# Altium project Projeto_DAC_Raspberry.PrjPcb
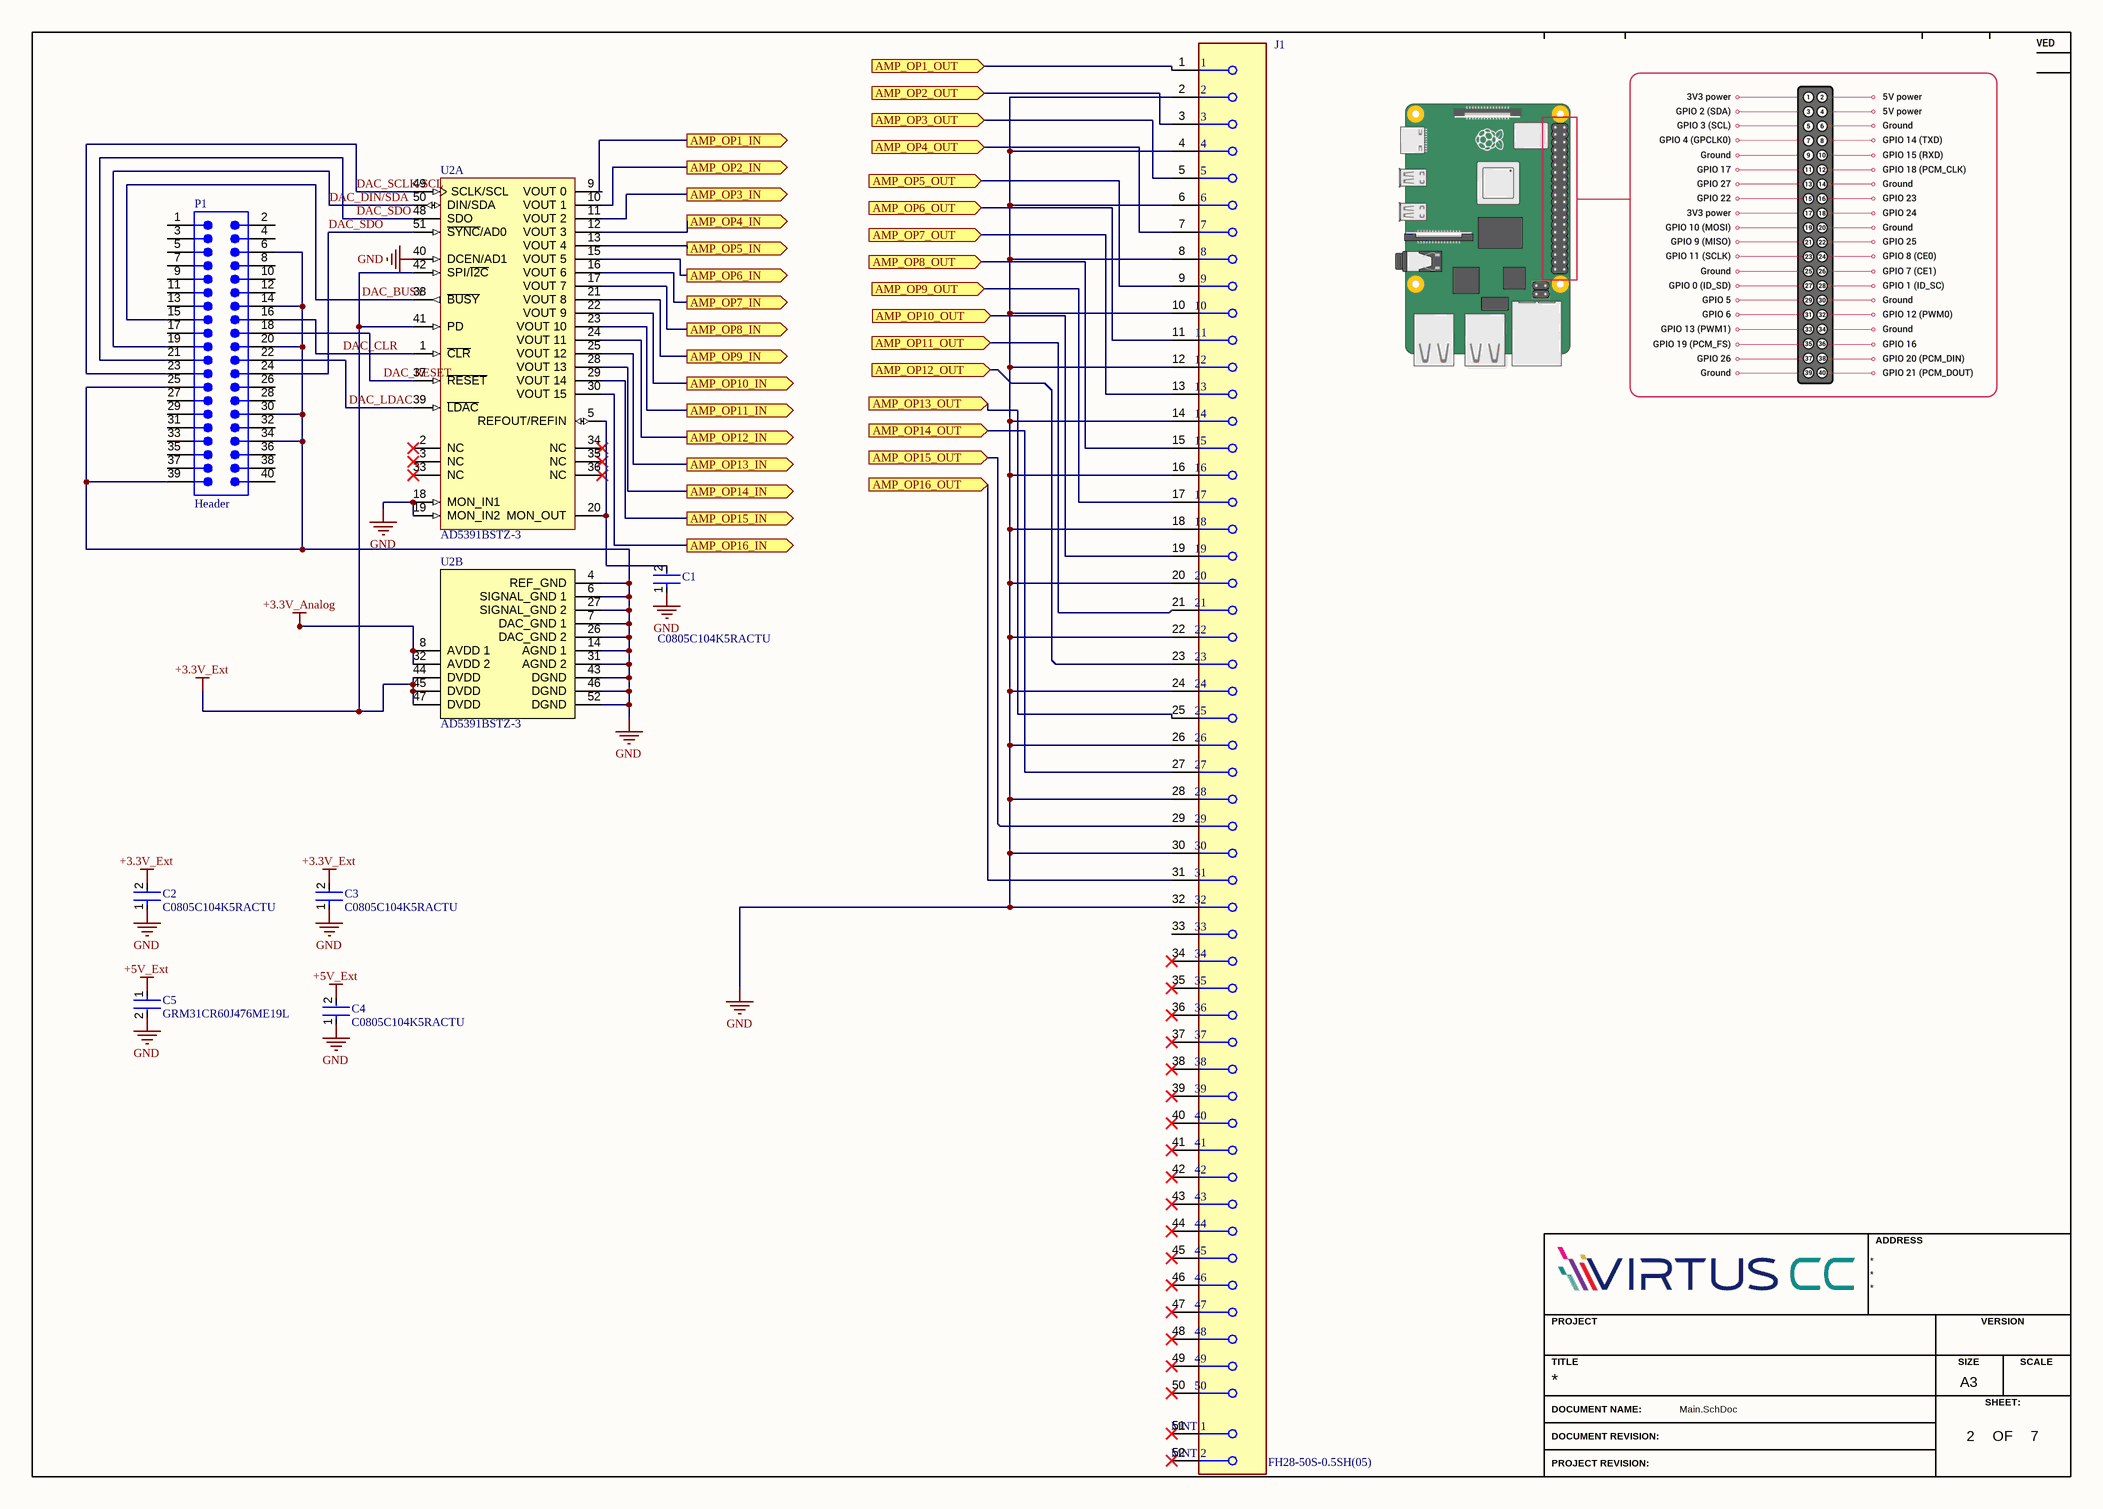
[diagram p0: Main.SchDoc]
1 sheet, 8 parts. Net scope: global (net labels, ports and power ports of the same name join across sheets).
Board file: RaspberryHatBoard1.PcbDoc

## Sheet Main.SchDoc
size A3; SheetNumber: 2; SheetTotal: 7

### Parts
C1  C0805C104K5RACTU  [FP-C0805C-DN-MFG]
C2  C0805C104K5RACTU  [FP-C0805C-DN-MFG]
C3  C0805C104K5RACTU  [FP-C0805C-DN-MFG]
C4  C0805C104K5RACTU  [FP-C0805C-DN-MFG]
C5  GRM31CR60J476ME19L  [FP-GRM31C-0_2-e0_3_0_8-IPC_C]
J1  FH28-50S-0.5SH(05)  [FP-FH28-50S-0_5SH_05-MFG]
P1  Header  [61204021621]
U2  AD5391BSTZ-3  [ST-52_L]  (parts A,B of 2)

### Ports
AMP_OP1_IN (out, see Amp_op1[2B]), AMP_OP1_OUT (in, see Amp_op1[6A]), AMP_OP2_IN (out, see Amp_op1[2B]), AMP_OP2_OUT (in, see Amp_op1[6B]), AMP_OP3_IN (out, see Amp_op1[2B]), AMP_OP3_OUT (in, see Amp_op1[6B]), AMP_OP4_IN (out, see Amp_op1[2B]), AMP_OP4_OUT (in, see Amp_op1[6C]), AMP_OP5_IN (out, see Amp_op2[1B]), AMP_OP5_OUT (in, see Amp_op2[6A]), AMP_OP6_IN (out, see Amp_op2[1B]), AMP_OP6_OUT (in, see Amp_op2[6B]), AMP_OP7_IN (out, see Amp_op2[1B]), AMP_OP7_OUT (in, see Amp_op2[6C]), AMP_OP8_IN (out, see Amp_op2[1B]), AMP_OP8_OUT (in, see Amp_op2[6C]), AMP_OP9_IN (out, see Amp_op3[2B]), AMP_OP9_OUT (in, see Amp_op3[6A]), AMP_OP10_IN (out, see Amp_op3[2B]), AMP_OP10_OUT (in, see Amp_op3[6B]), AMP_OP11_IN (out, see Amp_op3[2B]), AMP_OP11_OUT (in, see Amp_op3[6B]), AMP_OP12_IN (out, see Amp_op3[2B]), AMP_OP12_OUT (in, see Amp_op3[6C]), AMP_OP13_IN (out, see Amp_op4[2B]), AMP_OP13_OUT (in, see Amp_op4[6A]), AMP_OP14_IN (out, see Amp_op4[2B]), AMP_OP14_OUT (in, see Amp_op4[6B]), AMP_OP15_IN (out, see Amp_op4[2B]), AMP_OP15_OUT (in, see Amp_op4[6B]), AMP_OP16_IN (out, see Amp_op4[2B]), AMP_OP16_OUT (in, see Amp_op4[6C])

### Nets
+3.3V_Analog: U2.8(AVDD_1) U2.32(AVDD_2)
+3.3V_Ext: C2.2 C3.2 U2.41(PD) U2.42(SPI/~{I2C}) U2.44(DVDD) U2.45(DVDD) U2.47(DVDD)
+5V_Ext: C4.2 C5.1
GND: C1.1 C2.1 C3.1 C4.1 C5.2 J1.2 J1.4 J1.6 J1.8 J1.10 J1.12 J1.14 J1.16 J1.18 J1.20 J1.22 J1.24 J1.26 J1.28 J1.30 J1.32 P1.6 P1.14 P1.20 P1.25 P1.30 P1.34 P1.39 U2.4(REF_GND) U2.6(SIGNAL_GND_1) U2.7(DAC_GND_1) U2.14(AGND_1) U2.18(MON_IN1) U2.19(MON_IN2) U2.26(DAC_GND_2) U2.27(SIGNAL_GND_2) U2.31(AGND_2) U2.40(DCEN/AD1) U2.43(DGND) U2.46(DGND) U2.52(DGND)
DAC_BUSY: P1.15 U2.38(~{BUSY})
DAC_CLR: P1.16 U2.1(~{CLR})
DAC_DIN/SDA: P1.19 U2.50(DIN/SDA)
DAC_LDAC: P1.22 U2.39(~{LDAC})
DAC_RESET: P1.18 U2.37(~{RESET})
DAC_SCLK/SCL: P1.23 U2.49(SCLK/SCL)
DAC_SDO: P1.21 P1.24 U2.48(SDO) U2.51(~{SYNC}/AD0)
NetC1_2: C1.2 U2.5(REFOUT/REFIN) U2.20(MON_OUT)
NetJ1_1: J1.1 ; port AMP_OP1_OUT
NetJ1_3: J1.3 ; port AMP_OP2_OUT
NetJ1_5: J1.5 ; port AMP_OP3_OUT
NetJ1_7: J1.7 ; port AMP_OP4_OUT
NetJ1_9: J1.9 ; port AMP_OP5_OUT
NetJ1_11: J1.11 ; port AMP_OP6_OUT
NetJ1_13: J1.13 ; port AMP_OP7_OUT
NetJ1_15: J1.15 ; port AMP_OP8_OUT
NetJ1_17: J1.17 ; port AMP_OP9_OUT
NetJ1_19: J1.19 ; port AMP_OP10_OUT
NetJ1_21: J1.21 ; port AMP_OP11_OUT
NetJ1_23: J1.23 ; port AMP_OP12_OUT
NetJ1_25: J1.25 ; port AMP_OP13_OUT
NetJ1_27: J1.27 ; port AMP_OP14_OUT
NetJ1_29: J1.29 ; port AMP_OP15_OUT
NetJ1_31: J1.31 ; port AMP_OP16_OUT
NetU2_9: U2.9(VOUT_0) ; port AMP_OP1_IN
NetU2_10: U2.10(VOUT_1) ; port AMP_OP2_IN
NetU2_11: U2.11(VOUT_2) ; port AMP_OP3_IN
NetU2_12: U2.12(VOUT_3) ; port AMP_OP4_IN
NetU2_13: U2.13(VOUT_4) ; port AMP_OP5_IN
NetU2_15: U2.15(VOUT_5) ; port AMP_OP6_IN
NetU2_16: U2.16(VOUT_6) ; port AMP_OP7_IN
NetU2_17: U2.17(VOUT_7) ; port AMP_OP8_IN
NetU2_21: U2.21(VOUT_8) ; port AMP_OP9_IN
NetU2_22: U2.22(VOUT_9) ; port AMP_OP10_IN
NetU2_23: U2.23(VOUT_10) ; port AMP_OP11_IN
NetU2_24: U2.24(VOUT_11) ; port AMP_OP12_IN
NetU2_25: U2.25(VOUT_12) ; port AMP_OP13_IN
NetU2_28: U2.28(VOUT_13) ; port AMP_OP14_IN
NetU2_29: U2.29(VOUT_14) ; port AMP_OP15_IN
NetU2_30: U2.30(VOUT_15) ; port AMP_OP16_IN

Not connected (* = marked no-connect by the designer): J1 33 34* 35* 36* 37* 38* 39* 40* 41* 42* 43* 44* 45* 46* 47* 48* 49* 50* 51(MNT_1)* 52(MNT_2)*; P1 1 2 3 4 5 7 8 9 10 11 12 13 17 26 27 28 29 31 32 33 35 36 37 38 40; U2 2(NC)* 3(NC)* 33(NC)* 34(NC)* 35(NC)* 36(NC)*

### Notes on the sheet
- REVISION
- DESCRIPTION
- DATE
- APPROVED
- ADDRESS
- PROJECT
- VERSION
- TITLE
- A3
- SIZE
- SCALE
- DOCUMENT NAME:
- DOCUMENT REVISION:
- OF
- SHEET:
- PROJECT REVISION:

### Library data of the parts
C1-C4 = CMP-2007-00279-2: CAP CER 0.1UF 50V X7R 0805; Manufacturer: KEMET; Value: 0.10 μF; Tolerance: 0.1; Temperature Coefficient: 30ppm/°C; Material: Ceramic; Manufacturer Part Number: C0805C104K5RACTU; Device Class L2: Capacitors; Temperature Range Low: -55°C; Voltage Rating: 50 V; Digikey Description: CAP CER 0.1UF 50V X7R 0805; Category: Cap; ComponentLink2Description: Datasheet; Octopart: https://octopart.com/c0805c104k5ractu-kemet-143926; RoHS: TRUE; ComponentLink2URL: https://content.kemet.com/datasheets/KEM_C1003_C0G_SMD.pdf; Temperature Characteristic: X7R; Temperature: -55°C to +125°C; Height: 0.88mm; Temperature Range High: +125°C; Device Class L1: Passive Components; Automotive: No; Lead Free: Yes; Ipc Land Pattern Name: CAPC200125X78; Device Class L3: Ceramic Capacitors; Mouser Description: Cap Ceramic 0.1uF 50V X7R 10% SMD 2.0 x 1.2 mm 125 C Paper T/R; Capacitance: 0.10 μF; Package: C0805C-DN
C5 = CMP-2000-06344-2: Chip Multilayer Ceramic Capacitors for General Purpose, 1206, 47uF, X5R, 15%, 20%, 6.3V; Package Quantity: 2000; Mount: Surface Mount; Length: 3.2mm; Thickness: 0.071inch; Lead Free: Lead Free; Tolerance: 20%; Width: 0.063inch; Depth: 1.6mm; Case/Package: 1206; Dielectric: X5R; Radiation Hardening: No; Packaging: Tape and Reel; Voltage Rating (DC): 6.3V; Termination: SMD/SMT; Height: 1.6mm; Max Operating Temperature: 85°C; Case Code (Metric): 3216; Case Code (Imperial): 1206; Voltage: 6.3V; Voltage Rating: 6.3V; Capacitance: 47uF; Min Operating Temperature: -55°C; Material: Ceramic; REACH SVHC: No SVHC
J1 = CMP-11609-000009-1: CONN FFC BOTTOM 50POS 0.50MM R/A; Manufacturer: Hirose Electric Co Ltd; Current Rating: 0.5A; Pitch: 0.5mm; Voltage Rating: 50V; Number Of Contacts: 50; Conn Gender: Female; Conn Orientation: Horizontal; Is Female: yes; ComponentLink2URL: http://www.hirose.co.jp/cataloge_hp/e58618038.pdf; Contact Material: Gold; Lead Free: Yes; Temperature: -40°C to +105°C; Digikey Description: CONN FFC BOTTOM 50POS 0.50MM R/A; Octopart: https://octopart.com/fh28-50s-0.5sh%2805%29-hirose-240232; Device Class L3: unset; RoHS: TRUE; Temperature Range High: +105°C; Height: 5.6mm; Device Class L1: Connectors; Package: 0; ComponentLink2Description: Datasheet; Automotive: No; Device Class L2: FFC / FPC; Category: Conn; Mouser Description: FFC & FPC Connectors 50POS 0.5MM SMT GOLD; Manufacturer Part Number: FH28-50S-0.5SH(05); Temperature Range Low: -40°C
P1 = CMP-1502-00015-4: WR-BHD Straight Male, Box Header, Through Hole, 2 Rows, 40 Contacts, 2.54mm Pitch; Number of Positions: 40; Contact Resistance: 20mΩ; Current Rating: 3A; Connector Type: Male Pin; Operating Supply Voltage: 250V; Insulation Resistance: 1GΩ; Color: Black; Row Spacing: 2.54mm; Pitch: 2.54mm; RoHS: Compliant; Max Operating Temperature: 105°C; Insulation Material: PBT; Number of Pins: 40; Contact Plating: Gold; Orientation: Vertical; Voltage Rating: 250V; Number of Rows: 2; Lead Pitch: 2.54mm; Length: 58.46mm; Mount: Through Hole; Gender: Male; Number of Contacts: 40; Height: 9.25mm; Min Operating Temperature: -40°C; Contact Material: Gold; Termination: Solder; REACH SVHC: Unknown
U2 = CMP-0318-00791-2: 16 Channel 12-Bit Single-Supply Voltage Output Digital-to-Analog Converter with Serial Interface, 3 V, -40 to +85 degC, ST-52, Pb-Free, Tray; Manufacturer: Analog Devices; Generic Part Number: AD5391; Single Supply: Yes; Max V+: 5.5V; Resolution (Bits): 12; # DAC Outputs: 16; Settling Time: 6Âµs; Code_JEDEC: MS-026-BCC; Packing: Tray; PartNumber: AD5391BSTZ-3; ComponentLink5Description: Reference Design URL; DatasheetVersion: Rev. D; PackageVersion: 2003; Mounting Technology: Surface Mount; PackageReference: ST-52; ComponentLink3Description: Package Specification; ComponentLink5URL: http://www.analog.com/en/digital-to-analog-converters/da-converters/ad5391/products/product.html#prod_cross_sell; RevisionNote: Component URL fixed; ComponentLink3URL: http://www.analog.com/static/imported-files/packages/61012411624300842189414155189544791816408612ST_52_10x10.pdf; PackageDescription: 52-Lead Low Profile Quad Flat Package [LQFP]; RoHS: Y; ComponentLink4URL: http://www.analog.com/en/digital-to-analog-converters/da-converters/ad5391/products/product.html; ComponentLink4Description: Product URL; ComponentLink2URL: http://www.analog.com/static/imported-files/data_sheets/AD5390_5391_5392.pdf; ComponentLink1URL: http://www.analog.com/en/index.html; ComponentLink1Description: Manufacturer URL; ComponentLink2Description: Datasheet